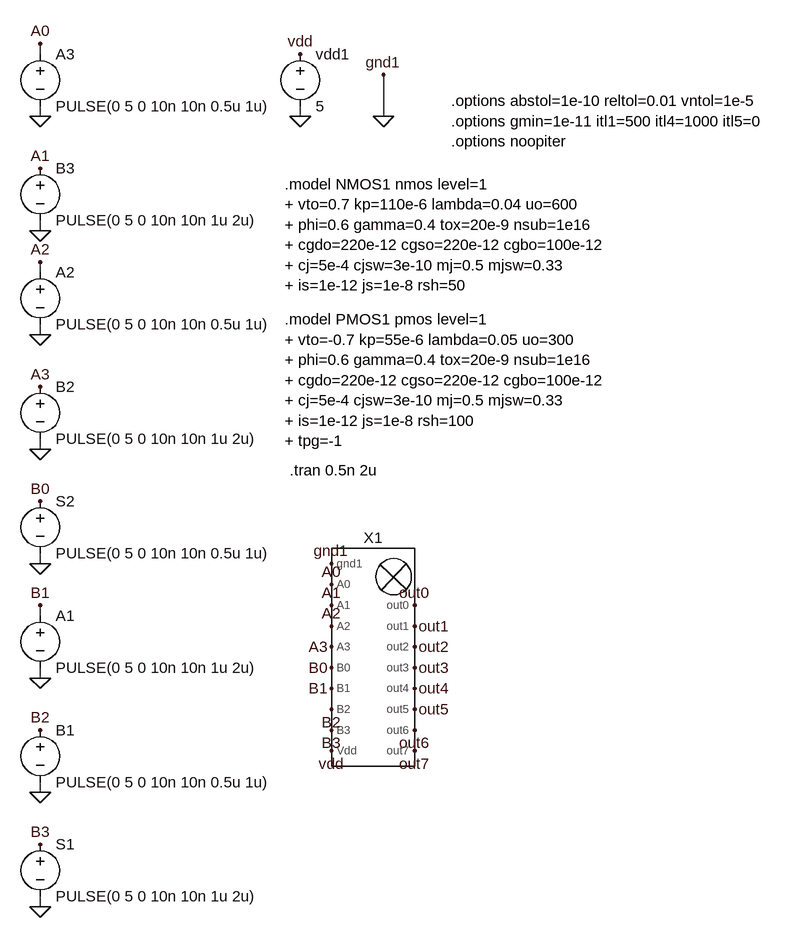
[diagram p0: schematic mult1_tb.asc]
mult1_tb.asc, the LTspice schematic file:
Version 4.1
SHEET 1 880 740
WIRE -576 -592 -576 -608
WIRE -576 -496 -576 -512
WIRE -176 -496 -176 -512
WIRE -48 -496 -48 -560
WIRE -576 -320 -576 -336
WIRE -576 -256 -576 -272
WIRE -576 -160 -576 -176
WIRE -576 16 -576 0
WIRE -576 192 -576 176
WIRE -576 272 -576 256
WIRE -576 368 -576 352
WIRE -576 544 -576 528
WIRE -576 720 -576 704
FLAG -176 -496 0
FLAG -576 368 0
FLAG -576 544 0
FLAG -176 -592 vdd
FLAG -576 256 B1
FLAG -576 448 B2
FLAG -48 -496 0
FLAG -48 -560 gnd1
FLAG -576 720 0
FLAG -576 624 B3
FLAG -576 -160 0
FLAG -576 16 0
FLAG -576 -272 A2
FLAG -576 -80 A3
FLAG -576 192 0
FLAG -576 96 B0
FLAG -576 -496 0
FLAG -576 -320 0
FLAG -576 -608 A0
FLAG -576 -416 A1
FLAG -128 192 gnd1
FLAG -128 480 vdd
FLAG -128 224 A0
FLAG -128 256 A1
FLAG -128 288 A2
FLAG -128 320 A3
FLAG -128 352 B0
FLAG -128 384 B1
FLAG -128 416 B2
FLAG -128 448 B3
FLAG 0 256 out0
FLAG 0 288 out1
FLAG 0 320 out2
FLAG 0 352 out3
FLAG 0 384 out4
FLAG 0 416 out5
FLAG 0 448 out6
FLAG 0 480 out7
SYMBOL mult1 -64 336 R0
SYMATTR InstName X1
SYMBOL voltage -576 432 R0
WINDOW 123 0 0 Left 0
WINDOW 39 0 0 Left 0
SYMATTR InstName B1
SYMATTR Value PULSE(0 5 0 10n 10n 0.5u 1u)
SYMBOL voltage -576 256 R0
WINDOW 123 0 0 Left 0
WINDOW 39 0 0 Left 0
SYMATTR InstName A1
SYMATTR Value PULSE(0 5 0 10n 10n 1u 2u)
SYMBOL voltage -176 -608 R0
SYMATTR InstName vdd1
SYMATTR Value 5
SYMBOL voltage -576 608 R0
WINDOW 123 0 0 Left 0
WINDOW 39 0 0 Left 0
SYMATTR InstName S1
SYMATTR Value PULSE(0 5 0 10n 10n 1u 2u)
SYMBOL voltage -576 -96 R0
WINDOW 123 0 0 Left 0
WINDOW 39 0 0 Left 0
SYMATTR InstName B2
SYMATTR Value PULSE(0 5 0 10n 10n 1u 2u)
SYMBOL voltage -576 -272 R0
WINDOW 123 0 0 Left 0
WINDOW 39 0 0 Left 0
SYMATTR InstName A2
SYMATTR Value PULSE(0 5 0 10n 10n 0.5u 1u)
SYMBOL voltage -576 80 R0
WINDOW 123 0 0 Left 0
WINDOW 39 0 0 Left 0
SYMATTR InstName S2
SYMATTR Value PULSE(0 5 0 10n 10n 0.5u 1u)
SYMBOL voltage -576 -432 R0
WINDOW 123 0 0 Left 0
WINDOW 39 0 0 Left 0
SYMATTR InstName B3
SYMATTR Value PULSE(0 5 0 10n 10n 1u 2u)
SYMBOL voltage -576 -608 R0
WINDOW 123 0 0 Left 0
WINDOW 39 0 0 Left 0
SYMATTR InstName A3
SYMATTR Value PULSE(0 5 0 10n 10n 0.5u 1u)
TEXT -200 -392 Left 2 !.model NMOS1 nmos level=1\n+ vto=0.7 kp=110e-6 lambda=0.04 uo=600\n+ phi=0.6 gamma=0.4 tox=20e-9 nsub=1e16\n+ cgdo=220e-12 cgso=220e-12 cgbo=100e-12\n+ cj=5e-4 cjsw=3e-10 mj=0.5 mjsw=0.33\n+ is=1e-12 js=1e-8 rsh=50
TEXT -200 -184 Left 2 !.model PMOS1 pmos level=1\n+ vto=-0.7 kp=55e-6 lambda=0.05 uo=300\n+ phi=0.6 gamma=0.4 tox=20e-9 nsub=1e16\n+ cgdo=220e-12 cgso=220e-12 cgbo=100e-12\n+ cj=5e-4 cjsw=3e-10 mj=0.5 mjsw=0.33\n+ is=1e-12 js=1e-8 rsh=100\n+ tpg=-1
TEXT -192 48 Left 2 !.tran 0.5n 2u
TEXT 56 -520 Left 2 !.options abstol=1e-10 reltol=0.01 vntol=1e-5\n.options gmin=1e-11 itl1=500 itl4=1000 itl5=0\n.options noopiter

The netlist it stands for:
* mult1_tb.asc
X§X1 A0 A1 A2 A3 B0 B1 B2 B3 0 out0 out1 out2 out3 out4 out5 out6 out7 vdd mult1  ; pins A0 A1 A2 A3 B0 B1 B2 B3 gnd1 out0 out1 out2 out3 out4 out5 out6 out7 Vdd
V§B1 B2 0 PULSE(0 5 0 10n 10n 0.5u 1u)
V§A1 B1 0 PULSE(0 5 0 10n 10n 1u 2u)
vdd1 vdd 0 5
V§S1 B3 0 PULSE(0 5 0 10n 10n 1u 2u)
V§B2 A3 0 PULSE(0 5 0 10n 10n 1u 2u)
V§A2 A2 0 PULSE(0 5 0 10n 10n 0.5u 1u)
V§S2 B0 0 PULSE(0 5 0 10n 10n 0.5u 1u)
V§B3 A1 0 PULSE(0 5 0 10n 10n 1u 2u)
V§A3 A0 0 PULSE(0 5 0 10n 10n 0.5u 1u)
.model NMOS1 nmos level=1
+ vto=0.7 kp=110e-6 lambda=0.04 uo=600
+ phi=0.6 gamma=0.4 tox=20e-9 nsub=1e16
+ cgdo=220e-12 cgso=220e-12 cgbo=100e-12
+ cj=5e-4 cjsw=3e-10 mj=0.5 mjsw=0.33
+ is=1e-12 js=1e-8 rsh=50
.model PMOS1 pmos level=1
+ vto=-0.7 kp=55e-6 lambda=0.05 uo=300
+ phi=0.6 gamma=0.4 tox=20e-9 nsub=1e16
+ cgdo=220e-12 cgso=220e-12 cgbo=100e-12
+ cj=5e-4 cjsw=3e-10 mj=0.5 mjsw=0.33
+ is=1e-12 js=1e-8 rsh=100
+ tpg=-1
.tran 0.5n 2u
.options abstol=1e-10 reltol=0.01 vntol=1e-5
.options gmin=1e-11 itl1=500 itl4=1000 itl5=0
.options noopiter
.backanno
.end